# Altium project ch55x_programmer.PrjPcb
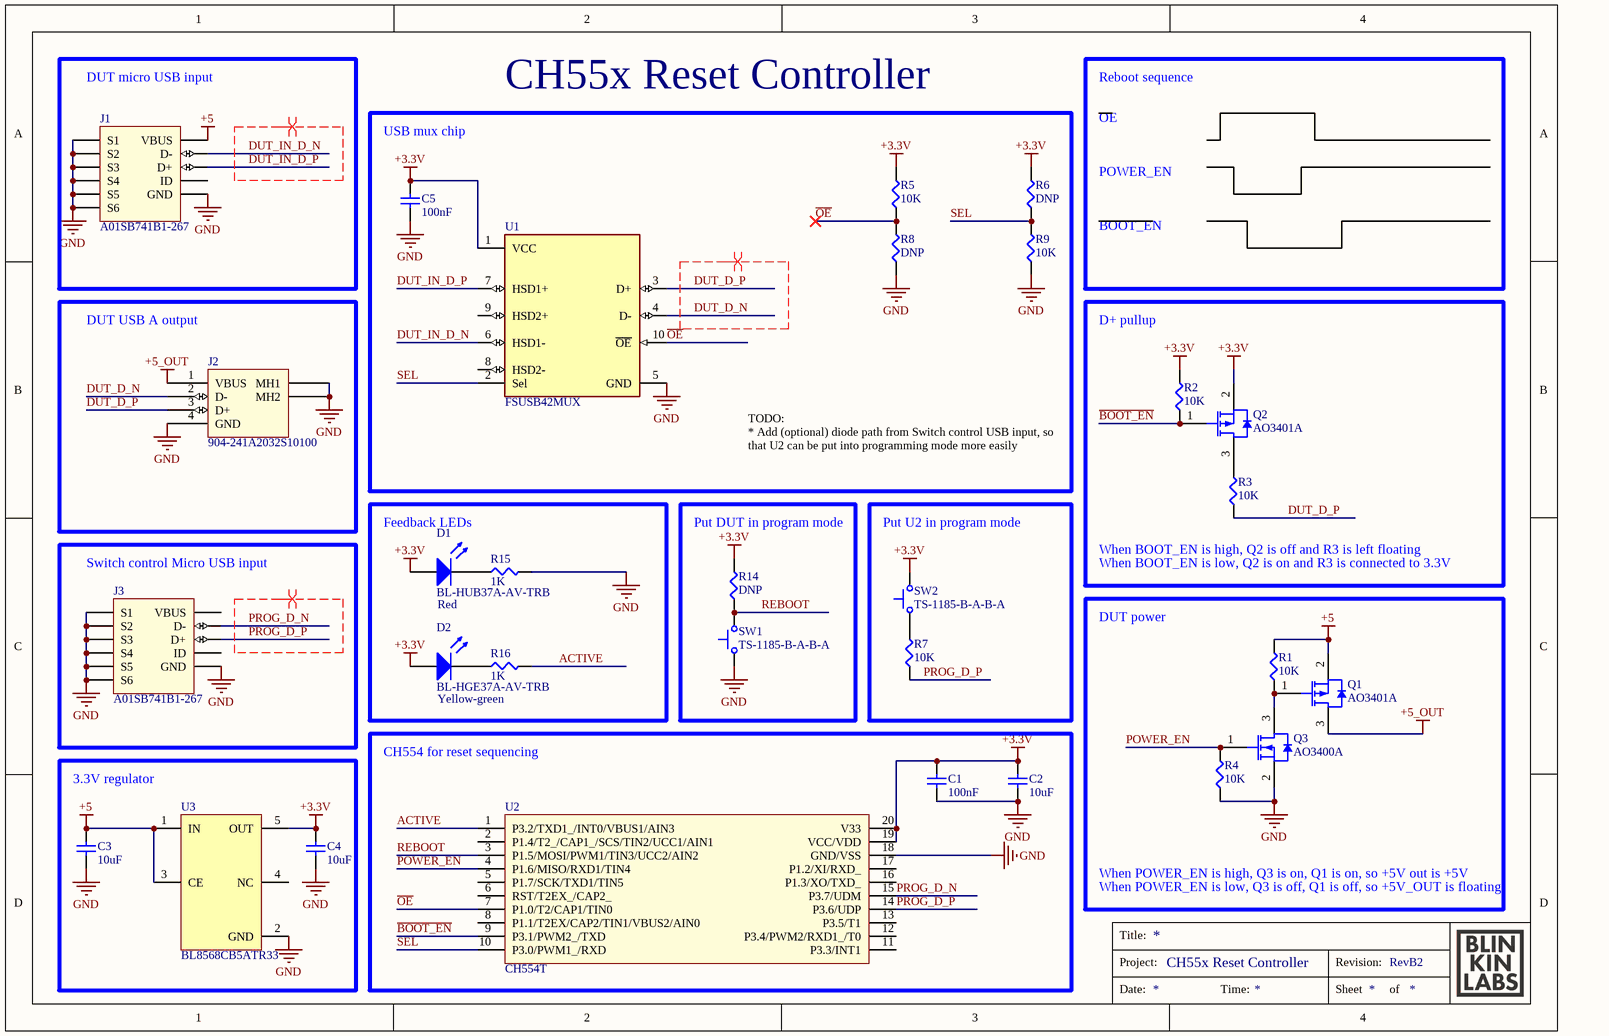
[diagram p0: Sheet1.SchDoc]
ReleaseDate: 2025-06; VersionRevision: RevB2; Project: CH55x Reset Controller
1 sheet, 30 parts. Net scope: global (net labels, ports and power ports of the same name join across sheets).
Board file: PCB1.PcbDoc

## Sheet Sheet1.SchDoc
size A4; Organization: Blinkinlabs, LLC

### Parts
C1  100nF  [CAPC1005X06L]
C2  10uF  [CAPC2012X10L]
C3  10uF  [CAPC2012X10L]
C4  10uF  [CAPC2012X10L]
C5  100nF  [CAPC1005X06L]
D1  BL-HUB37A-AV-TRB  [BL-Hxx37A-AV-TRB]
D2  BL-HGE37A-AV-TRB  [BL-Hxx37A-AV-TRB]
J1  A01SB741B1-267  [A01SB741B1-267]
J2  904-241A2032S10100  [C42605]
J3  A01SB741B1-267  [A01SB741B1-267]
Q1  AO3401A  [AO-SOT-23-3L_V]
Q2  AO3401A  [AO-SOT-23-3L_V]
Q3  AO3400A  [AO-SOT-23-3L_V]
R1  10K  [ERJ2G(0402)_L]
R2  10K  [ERJ2G(0402)_L]
R3  10K  [ERJ2G(0402)_L]
R4  10K  [ERJ2G(0402)_L]
R5  10K  [ERJ2G(0402)_L]
R6  DNP  [ERJ2G(0402)_L]  (no BOM)
R7  10K  [ERJ2G(0402)_L]
R8  DNP  [ERJ2G(0402)_L]  (no BOM)
R9  10K  [ERJ2G(0402)_L]
R14  DNP  [ERJ2G(0402)_L]  (no BOM)
R15  1K  [ERJ2G(0402)_L]
R16  1K  [ERJ2G(0402)_L]
SW1  TS-1185-B-A-B-A  [TS-1185]
SW2  TS-1185-B-A-B-A  [TS-1185]
U1  FSUSB42MUX  [FP-846AP-MFG]
U2  CH554T  [TSOP65P660X110-20N]
U3  BL8568CB5ATR33  [SOT95P280X130-5N-2]

### Blocks framed on the sheet
DUT micro USB input: J1
USB mux chip: C5 R5 R6 R8 R9 U1
DUT USB A output: J2
Feedback LEDs: D1 D2 R15 R16
Put DUT in program mode: R14 SW1
Put U2 in program mode: R7 SW2
Switch control Micro USB input: J3
CH554 for reset sequencing: C1 C2 U2
3.3V regulator: C3 C4 U3

### Nets
+3.3V: C1.1 C2.1 C4.1 C5.1 D1.1 D2.1 Q2.2(SOURCE) R2.2 R5.2 R6.2 R14.2 SW2.2 U1.1(VCC) U2.19(VCC/VDD) U2.20(V33) U3.5(OUT)
+5: C3.1 J1.VBUS Q1.2(SOURCE) R1.2 U3.1(IN) U3.3(CE)
+5_OUT: J2.1(VBUS) Q1.3(DRAIN)
GND: C1.2 C2.2 C3.2 C4.2 C5.2 J1.GND J1.S1 J1.S2 J1.S3 J1.S4 J1.S5 J1.S6 J2.4(GND) J2.5(MH2) J2.6(MH1) J3.GND J3.S1 J3.S2 J3.S3 J3.S4 J3.S5 J3.S6 Q3.2(SOURCE) R4.1 R8.1 R9.1 R15.2 SW1.1 U1.5(GND) U2.18(GND/VSS) U3.2(GND)
ACTIVE: R16.2 U2.1(P3.2/TXD1_/INT0/VBUS1/AIN3)
~{BOOT_EN}: Q2.1(GATE) R2.1 U2.9(P3.1/PWM2_/TXD)
DUT_D_N: J2.2(D-) U1.4(D-)
DUT_D_P: J2.3(D+) R3.1 U1.3(D+)
DUT_IN_D_N: J1.D- U1.6(HSD1-)
DUT_IN_D_P: J1.D+ U1.7(HSD1+)
~{OE}: R5.1 R8.2 U1.10(~{OE}) U2.7(P1.0/T2/CAP1/TIN0)
POWER_EN: Q3.1(GATE) R4.2 U2.4(P1.6/MISO/RXD1/TIN4)
PROG_D_N: J3.D- U2.15(P3.7/UDM)
PROG_D_P: J3.D+ R7.1 U2.14(P3.6/UDP)
REBOOT: R14.1 SW1.2 U2.3(P1.5/MOSI/PWM1/TIN3/UCC2/AIN2)
SEL: R6.1 R9.2 U1.2(Sel) U2.10(P3.0/PWM1_/RXD)
NetD1_2: D1.2 R15.1
NetD2_2: D2.2 R16.1
NetQ1_1: Q1.1(GATE) Q3.3(DRAIN) R1.1
NetQ2_3: Q2.3(DRAIN) R3.2
NetR7_2: R7.2 SW2.1

Not connected (* = marked no-connect by the designer): J1 ID; J3 ID VBUS; U1 8(HSD2-) 9(HSD2+); U2 2(P1.4/T2_/CAP1_/SCS/TIN2/UCC1/AIN1) 5(P1.7/SCK/TXD1/TIN5) 6(RST/T2EX_/CAP2_) 8(P1.1/T2EX/CAP2/TIN1/VBUS2/AIN0) 11(P3.3/INT1) 12(P3.4/PWM2/RXD1_/T0) 13(P3.5/T1) 16(P1.3/XO/TXD_) 17(P1.2/XI/RXD_); U3 4(NC)

### Layout directives
differential pair; differential pair class D90: DUT_D_N, DUT_D_P, DUT_IN_D_N, DUT_IN_D_P, PROG_D_N, PROG_D_P

### Notes on the sheet
- Reboot sequence
- OE
- POWER_EN
- BOOT_EN
- D+ pullup
- TODO:
  * Add (optional) diode path from Switch control USB input, so that U2 can be put into programming mode more easily
- (near R3) When BOOT_EN is high, Q2 is off and R3 is left floating
- When BOOT_EN is low, Q2 is on and R3 is connected to 3.3V
- (near D1) Red
- DUT power
- Yellow-green
- When POWER_EN is high, Q3 is on, Q1 is on, so +5V out is +5V
- When POWER_EN is low, Q3 is off, Q1 is off, so +5V_OUT is floating
- Title:
- Project:
- Revision:
- Date:
- Time:
- Sheet
- of

### Library data of the parts
C1 C5 = CC0402KRX5R9BB104: CAP SMD 100nF 10% 50V X5R 0402; Manufacturer 1: Yageo; Kicad Symbol: Device:C; Kicad Footprint: bl_footprints:CAPC1005X06L; Value: 100nF; Tolerance: 10%; Voltage: 50V; Part Name: CC0402KRX5R9BB104; Type: X5R; Case/Package: 0402; Manufacturer Part Number 1: CC0402KRX5R9BB104; Supplier 1: DigiKey; Supplier Part Number 1: 311-3342-2-ND
C2-C4 = CC0805KRX5R8BB106: CAP SMD 10uF 10% 25V X5R 0805; Manufacturer 1: Yageo; Kicad Symbol: Device:C; Kicad Footprint: bl_footprints:CAPC2012X10L; Value: 10uF; Tolerance: 10%; Voltage: 25V; Part Name: CC0805KRX5R8BB106; Type: X5R; Case/Package: 0805; Manufacturer Part Number 1: CC0805KRX5R8BB106; Supplier 1: DigiKey; Supplier Part Number 1: 13-CC0805KRX5R8BB106TR-ND
D1 = BL-HUB37A-AV-TRB: LED, 0402, Super Red, 50mcd@20mA, 627~637nm; Manufacturer 1: BrtLed; id: 80; Kicad Symbol: Device:LED; Kicad Footprint: LED_SMD:LED_0402_1005Metric; Part Name: BL-HUB37A-AV-TRB; Manufacturer Part Number 1: BL-HUB37A-AV-TRB; Supplier 1: LCSC; Supplier Part Number 1: C165980; Value: BL-HUB37A-AV-TRB; Case/Package: 0402
D2 = BL-HGE37A-AV-TRB: LED, 0402, Super Yellow Green, 35mcd@20mA, 566~576nm; Manufacturer 1: BrtLed; id: 78; Kicad Symbol: Device:LED; Kicad Footprint: LED_SMD:LED_0402_1005Metric; Part Name: BL-HGE37A-AV-TRB; Manufacturer Part Number 1: BL-HGE37A-AV-TRB; Supplier 1: LCSC; Supplier Part Number 1: C165979; Value: BL-HGE37A-AV-TRB; Case/Package: 0402
J1 J3 = A01SB741B1-267: Micro USB B type ??????; Manufacturer 1: Unknown/Generic; id: 40; Part Name: A01SB741B1-267; Manufacturer Part Number 1: Unknown/Generic; Value: A01SB741B1-267; Case/Package: SMD
J2 = 904-241A2032S10100: USB A connector, SMD, no tabs; Manufacturer 1: Jing Extension of the Electronic Co.; id: 38; Part Name: 904-241A2032S10100; Manufacturer Part Number 1: 904-241A2032S10100; Supplier 1: LCSC; Supplier Part Number 1: C42605; Value: 904-241A2032S10100; Case/Package: SMD
Q1 Q2 = AO3401A: MOSFET P-CH 30V 4A SOT23-3L; Manufacturer 1: Alpha & Omega Semiconductor Inc.; Manufacturer Case/Package 1: 3-SMD, SOT-23-3 Variant; id: 47; Part Name: AO3401A; Manufacturer Part Number 1: AO3401A; Supplier 1: DigiKey; Supplier Part Number 1: 785-1001-2-ND; Supplier 2: LCSC; Supplier Part Number 2: C15127; Value: AO3401A; Case/Package: SOT-23-3
Q3 = AO3400A: MOSFET N-CH 30V 5.7A SOT23-3L; Manufacturer 1: Alpha & Omega Semiconductor Inc.; Manufacturer Case/Package 1: 3-SMD, SOT-23-3 Variant; id: 46; Part Name: AO3400A; Manufacturer Part Number 1: AO3400A; Supplier 1: DigiKey; Supplier Part Number 1: 785-1000-2-ND; Supplier 2: LCSC; Supplier Part Number 2: C20917; Value: AO3400A; Case/Package: SOT-23-3; Part Status: Discontinued
R1-R5 R7 R9 = RC0402JR-0710KL: RES SMD 10K OHM 5% 1/16W 0402; Manufacturer 1: Yageo; Kicad Symbol: Device:R_US; Kicad Footprint: bl_footprints:ERJ2G(0402)_L; Value: 10K; Tolerance: 5%; Part Name: RC0402JR-0710KL; Power: 1/16W; Case/Package: 0402; Manufacturer Part Number 1: RC0402JR-0710KL; Supplier 1: DigiKey; Supplier Part Number 1: 311-10KJRTR-ND
R6 R8 R14 = RES_0402_DNP: Part Name: RES_0402_DNP; PartNumber: DNP; Value: DNP; Package / Case: 0402 (1005 Metric)
R15 R16 = RC0402JR-071KL: RES SMD 1K OHM 5% 1/16W 0402; Manufacturer 1: Yageo; Kicad Symbol: Device:R_US; Kicad Footprint: bl_footprints:ERJ2G(0402)_L; Value: 1K; Tolerance: 5%; Part Name: RC0402JR-071KL; Power: 1/16W; Case/Package: 0402; Manufacturer Part Number 1: RC0402JR-071KL; Supplier 1: DigiKey; Supplier Part Number 1: 311-1.0KJRTR-ND
SW1 SW2 = TS-1185-B-A-B-A: Tactile switch, SPST, 3x4mm, 50mA 160gf 12V, no mounting pins; Manufacturer 1: XKB; id: 293; Kicad Symbol: Switch:SW_Push; Kicad Footprint: bl_footprints:TS-1185; Part Name: TS-1185-B-A-B-A; Manufacturer Part Number 1: TS-1185-B-A-B-A; Supplier 1: LCSC; Supplier Part Number 1: C561517; Value: TS-1185-B-A-B-A; Case/Package: SMD
U1 = FSUSB42MUX: USB Switch IC 1 Channel 10-MSOP; Manufacturer 1: onsemi; id: 661; Case/Package: 10-TFSOP, 10-MSOP (0.118", 3.00mm Width); Part Name: FSUSB42MUX; Manufacturer Part Number 1: FSUSB42MUX; Supplier 1: DigiKey; Supplier Part Number 1: FSUSB42MUXCT-ND; Supplier 2: LCSC; Supplier Part Number 2: C11355; Value: FSUSB42MUX; Manufacturer Case/Package 1: 10-MSOP
U2 = CH554T: 8-bit enhanced USB microcontroller; Manufacturer 1: WCH; Manufacturer Case/Package 1: TSSOP-20; id: 104; Part Name: CH554T; Manufacturer Part Number 1: CH554T; Supplier 1: LCSC; Supplier Part Number 1: C2928938; Value: CH554T
U3 = BL8568CB5ATR33: 500mA High PSRR, Linear Regulator, w. Output Discharge; Manufacturer 1: Shanghai Belling; id: 88; Part Name: BL8568CB5ATR33; Manufacturer Part Number 1: BL8568CB5ATR33; Supplier 1: LCSC; Supplier Part Number 1: C243122; Value: BL8568CB5ATR33